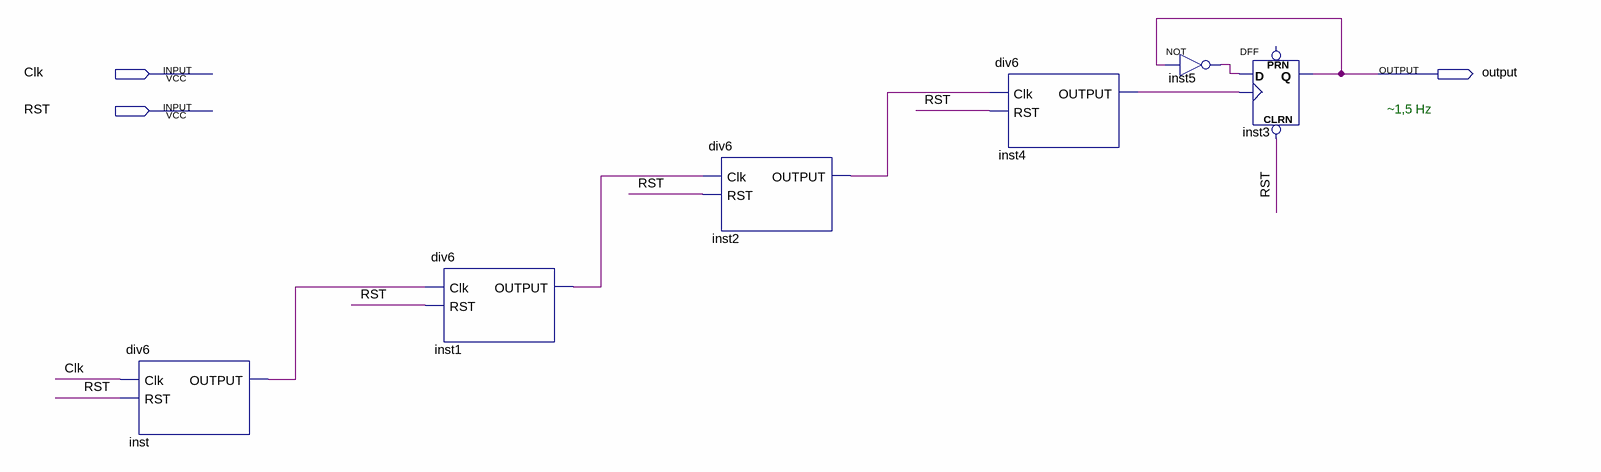
[diagram p0: schematic sheet]
// Quartus schematic divisor_clk.bdf as structural Verilog: 6 symbols, 3 pins
module divisor_clk (
  input  Clk,
  input  RST,
  output \output 
);

  wire inst1_output, inst2_output, inst4_output, inst5_out, inst_output;

  div6 inst (.Clk(Clk), .RST(RST), .OUTPUT(inst_output));
  div6 inst1 (.Clk(inst_output), .RST(RST), .OUTPUT(inst1_output));
  div6 inst2 (.Clk(inst1_output), .RST(RST), .OUTPUT(inst2_output));
  div6 inst4 (.Clk(inst2_output), .RST(RST), .OUTPUT(inst4_output));
  not inst5 (inst5_out, \output );
  DFF inst3 (.CLRN(RST), .CLK(inst4_output), .D(inst5_out), .Q(\output ));  // open: PRN

  // Notes on the sheet:
  //   ~1,5 Hz
endmodule
